# EAGLE design IOIO (EAGLE 6.3)
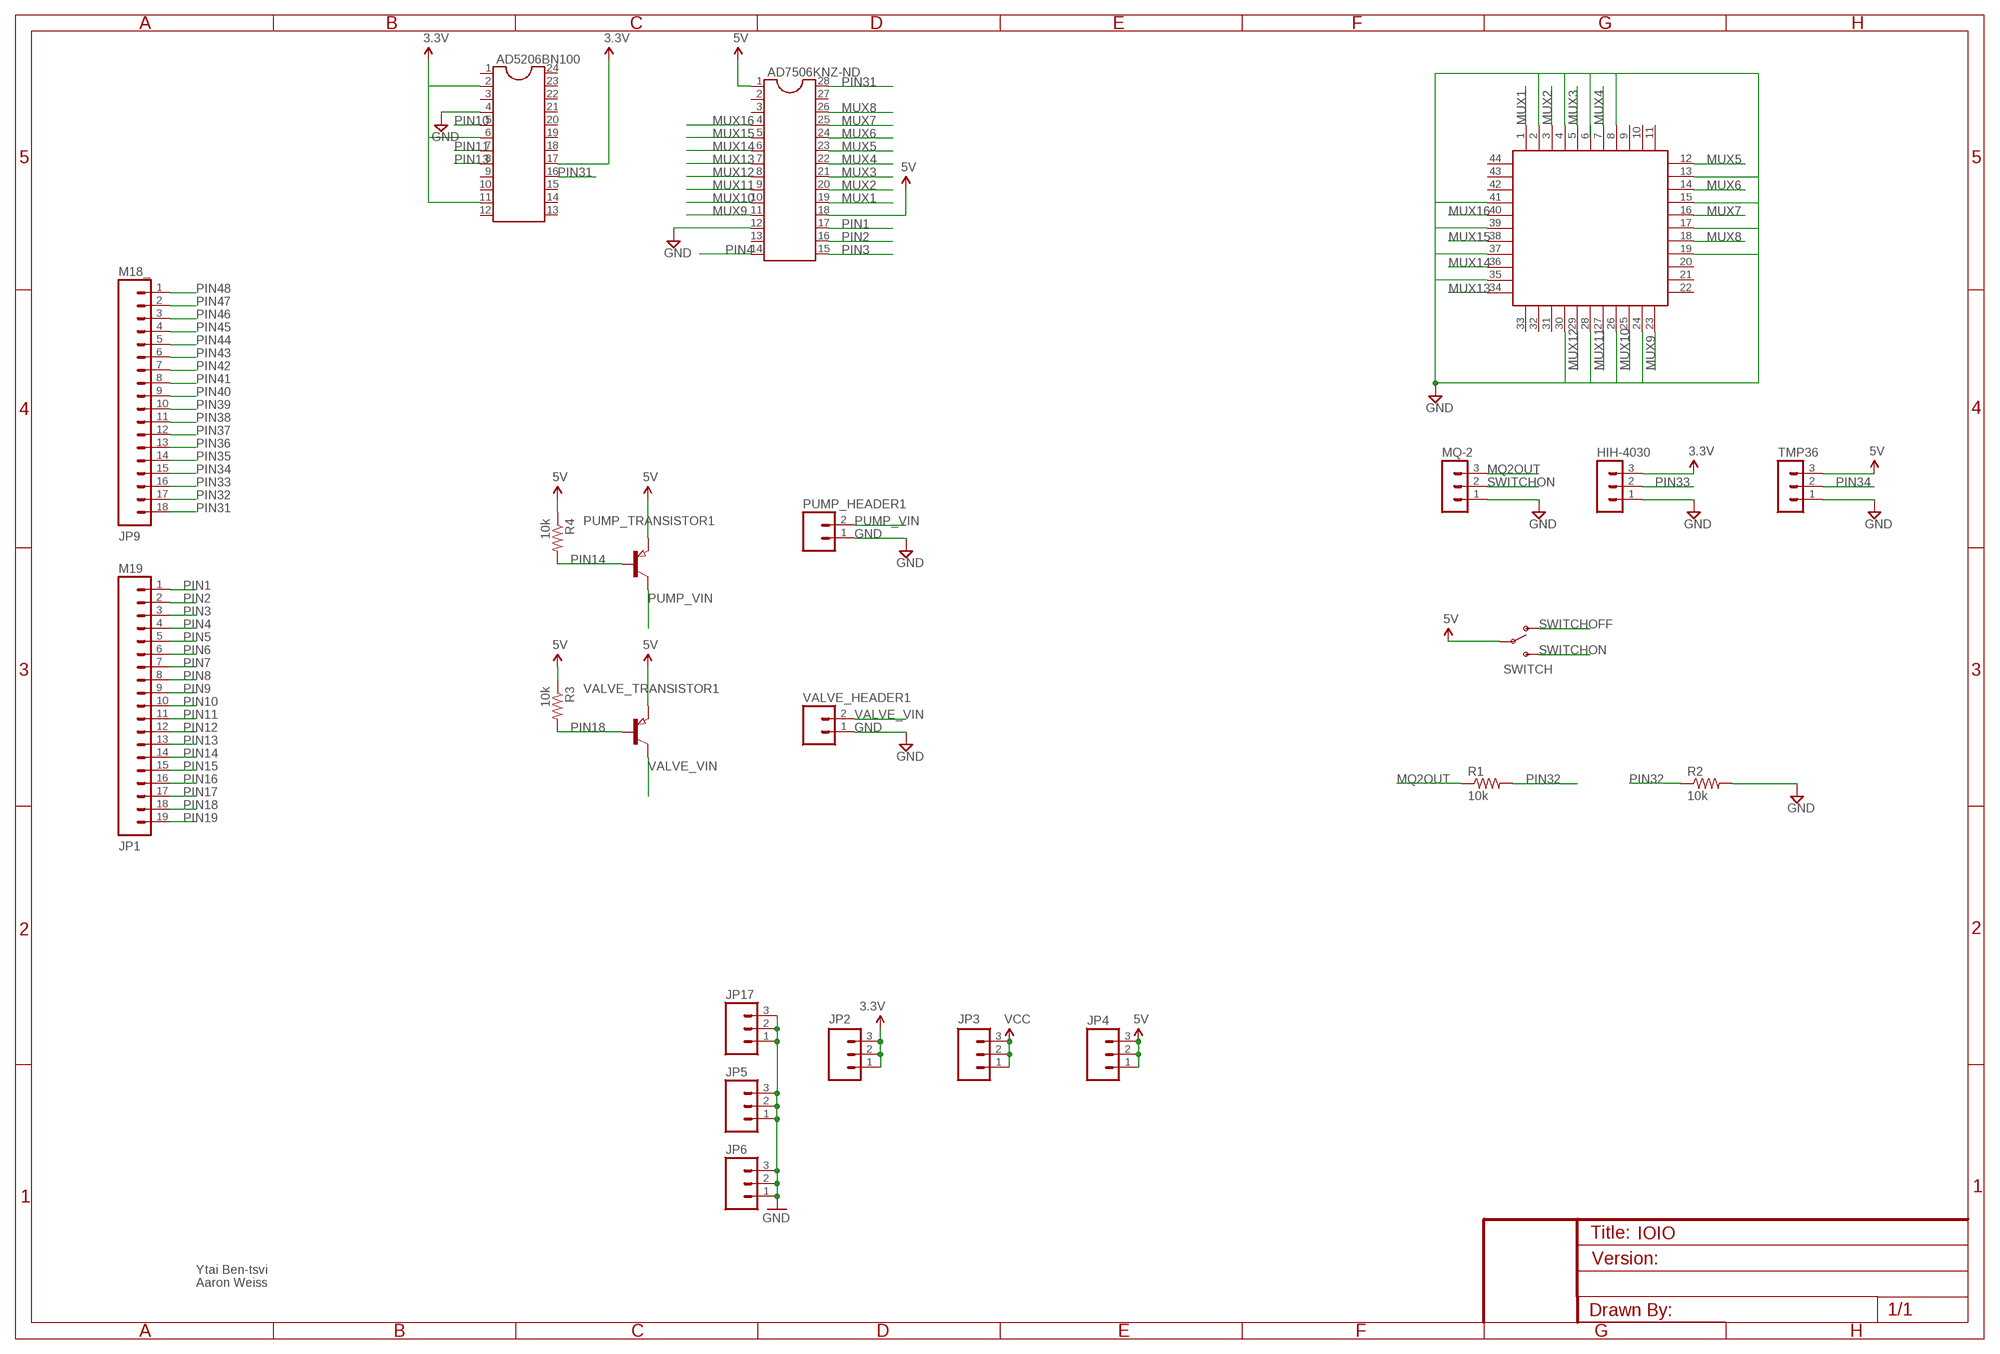
[diagram p0: schematic, sheet 1]

## Parts
AD5206BN100  DIL24-3  [DIL24-3]
AD7506KNZ-ND  DIL28  [DIL28-6]
HIH-4030  MA03-1  [MA03-1]
JP1  M19  [1X19]
JP2  M03PTH  [1X03]
JP3  M03PTH  [1X03]
JP4  M03PTH  [1X03]
JP5  M03PTH  [1X03]
JP6  M03PTH  [1X03]
JP9  M18_  [1X18]
JP17  M03PTH  [1X03]
MQ-2  MA03-1  [MA03-1]
PUMP_HEADER1  M02PTH  [1X02]
PUMP_TRANSISTOR1  PNP-TRANSISTOR_SOT23  [SOT23]
R1  10k  R-US_0207/7  [0207/7]
R2  10k  R-US_0207/7  [0207/7]
R3  10k  R-US_M2012  [M2012]
R4  10k  R-US_M2012  [M2012]
SWITCH  SWITCH-SPSTPTH  [SWITCH-SPDT]
TMP36  MA03-1  [MA03-1]
U$1  S44  [S44]
VALVE_HEADER1  M02PTH  [1X02]
VALVE_TRANSISTOR1  PNP-TRANSISTOR_SOT23  [SOT23]

## Nets
3.3V: AD5206BN100.2 AD5206BN100.6 AD5206BN100.11 AD5206BN100.17 HIH-4030.3 JP2.1 JP2.2 JP2.3
5V: AD7506KNZ-ND.1 AD7506KNZ-ND.18 JP4.1 JP4.2 JP4.3 PUMP_TRANSISTOR1.2(E) R3.1 R4.1 SWITCH.2(P) TMP36.3 VALVE_TRANSISTOR1.2(E)
GND: AD5206BN100.4 AD7506KNZ-ND.12 HIH-4030.1 JP5.1 JP5.2 JP5.3 JP6.1 JP6.2 JP6.3 JP17.1 JP17.2 JP17.3 MQ-2.1 PUMP_HEADER1.1 R2.2 TMP36.1 U$1.2 U$1.4 U$1.8 U$1.13 U$1.15 U$1.17 U$1.19 U$1.24 U$1.26 U$1.28 U$1.30 U$1.35 U$1.37 U$1.39 U$1.41 VALVE_HEADER1.1
MQ2OUT: MQ-2.3 R1.1
MUX1: AD7506KNZ-ND.19 U$1.1
MUX2: AD7506KNZ-ND.20 U$1.3
MUX3: AD7506KNZ-ND.21 U$1.5
MUX4: AD7506KNZ-ND.22 U$1.7
MUX5: AD7506KNZ-ND.23 U$1.12
MUX6: AD7506KNZ-ND.24 U$1.14
MUX7: AD7506KNZ-ND.25 U$1.16
MUX8: AD7506KNZ-ND.26 U$1.18
MUX9: AD7506KNZ-ND.11 U$1.23
MUX10: AD7506KNZ-ND.10 U$1.25
MUX11: AD7506KNZ-ND.9 U$1.27
MUX12: AD7506KNZ-ND.8 U$1.29
MUX13: AD7506KNZ-ND.7 U$1.34
MUX14: AD7506KNZ-ND.6 U$1.36
MUX15: AD7506KNZ-ND.5 U$1.38
MUX16: AD7506KNZ-ND.4 U$1.40
PIN1: AD7506KNZ-ND.17 JP1.1
PIN2: AD7506KNZ-ND.16 JP1.2
PIN3: AD7506KNZ-ND.15 JP1.3
PIN4: AD7506KNZ-ND.14 JP1.4
PIN5: JP1.5
PIN6: JP1.6
PIN7: JP1.7
PIN8: JP1.8
PIN9: JP1.9
PIN10: AD5206BN100.5 JP1.10
PIN11: AD5206BN100.7 JP1.11
PIN12: JP1.12
PIN13: AD5206BN100.8 JP1.13
PIN14: JP1.14 PUMP_TRANSISTOR1.1(B) R4.2
PIN15: JP1.15
PIN16: JP1.16
PIN17: JP1.17
PIN18: JP1.18 R3.2 VALVE_TRANSISTOR1.1(B)
PIN19: JP1.19
PIN31: AD5206BN100.16 AD7506KNZ-ND.28 JP9.18
PIN32: JP9.17 R1.2 R2.1
PIN33: HIH-4030.2 JP9.16
PIN34: JP9.15 TMP36.2
PIN35: JP9.14
PIN36: JP9.13
PIN37: JP9.12
PIN38: JP9.11
PIN39: JP9.10
PIN40: JP9.9
PIN41: JP9.8
PIN42: JP9.7
PIN43: JP9.6
PIN44: JP9.5
PIN45: JP9.4
PIN46: JP9.3
PIN47: JP9.2
PIN48: JP9.1
PUMP_VIN: PUMP_HEADER1.2 PUMP_TRANSISTOR1.3(C)
SWITCHOFF: SWITCH.1(O)
SWITCHON: MQ-2.2 SWITCH.3(S)
VALVE_VIN: VALVE_HEADER1.2 VALVE_TRANSISTOR1.3(C)
VCC: JP3.1 JP3.2 JP3.3
Unconnected: AD5206BN100.1 AD5206BN100.3 AD5206BN100.9 AD5206BN100.10 AD5206BN100.12 AD5206BN100.13 AD5206BN100.14 AD5206BN100.15 AD5206BN100.18 AD5206BN100.19 AD5206BN100.20 AD5206BN100.21 AD5206BN100.22 AD5206BN100.23 AD5206BN100.24 AD7506KNZ-ND.2 AD7506KNZ-ND.3 AD7506KNZ-ND.13 AD7506KNZ-ND.27 U$1.6 U$1.9 U$1.10 U$1.11 U$1.20 U$1.21 U$1.22 U$1.31 U$1.32 U$1.33 U$1.42 U$1.43 U$1.44

## Notes on the sheet
- Ytai Ben-tsvi
- Aaron Weiss

## Library data of the parts
AD5206BN100 = ic-package:DIL24: Dual In Line
AD7506KNZ-ND = ic-package:DIL28: Dual In Line
HIH-4030 MQ-2 TMP36 = con-lstb:MA03-1: PIN HEADER; OC_FARNELL: unknown; OC_NEWARK: unknown
JP1 = SparkFun:M19
JP2-JP6 JP17 = SparkFun:M03: Header 3 Standard 3-pin 0.1" header. Use with straight break away headers (SKU : PRT-00116), right angle break away headers (PRT-00553), swiss pins (PRT-00743), machine pins (PRT-00117), and female headers (PRT-00115). Molex polarized connector foot print use with SKU : PRT-08232 with associated crimp pins and housings.
JP9 = SparkFun:M18
PUMP_HEADER1 VALVE_HEADER1 = SparkFun:M02: Header 2 Standard 2-pin 0.1" header. Use with straight break away headers (SKU : PRT-00116), right angle break away headers (PRT-00553), swiss pins (PRT-00743), machine pins (PRT-00117), and female headers (PRT-00115). Molex polarized connector foot print use with SKU : PRT-08233 with associated crimp pins and housings.
PUMP_TRANSISTOR1 VALVE_TRANSISTOR1 = semicon-smd-ipc:PNP-TRANSISTOR_: PNP TRANSISTOR
R1-R4 = rcl:R-US_: RESISTOR, American symbol
SWITCH = SparkFun:SWITCH-SPST: SPST Switch Simple slide switch. Spark Fun Electronics SKU : COM-00102
U$1 = plcc-socket:S44: 44-pin PLCC through-hole socket

## Board
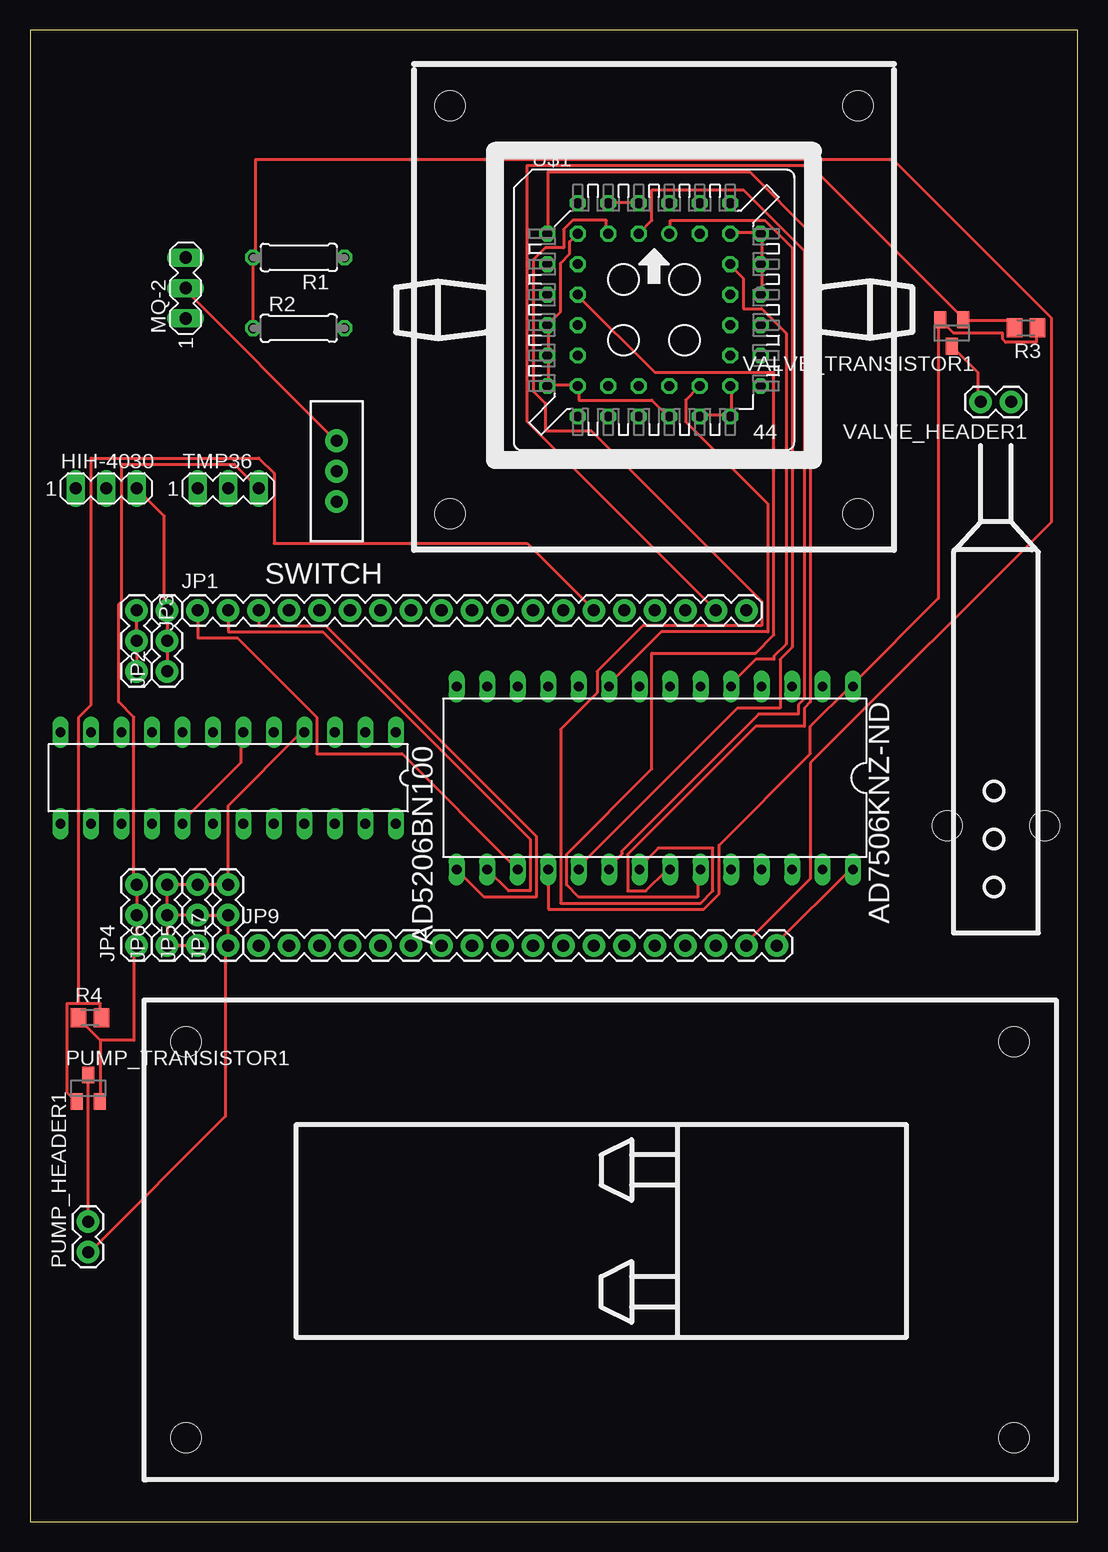
[diagram p1: board, top side]
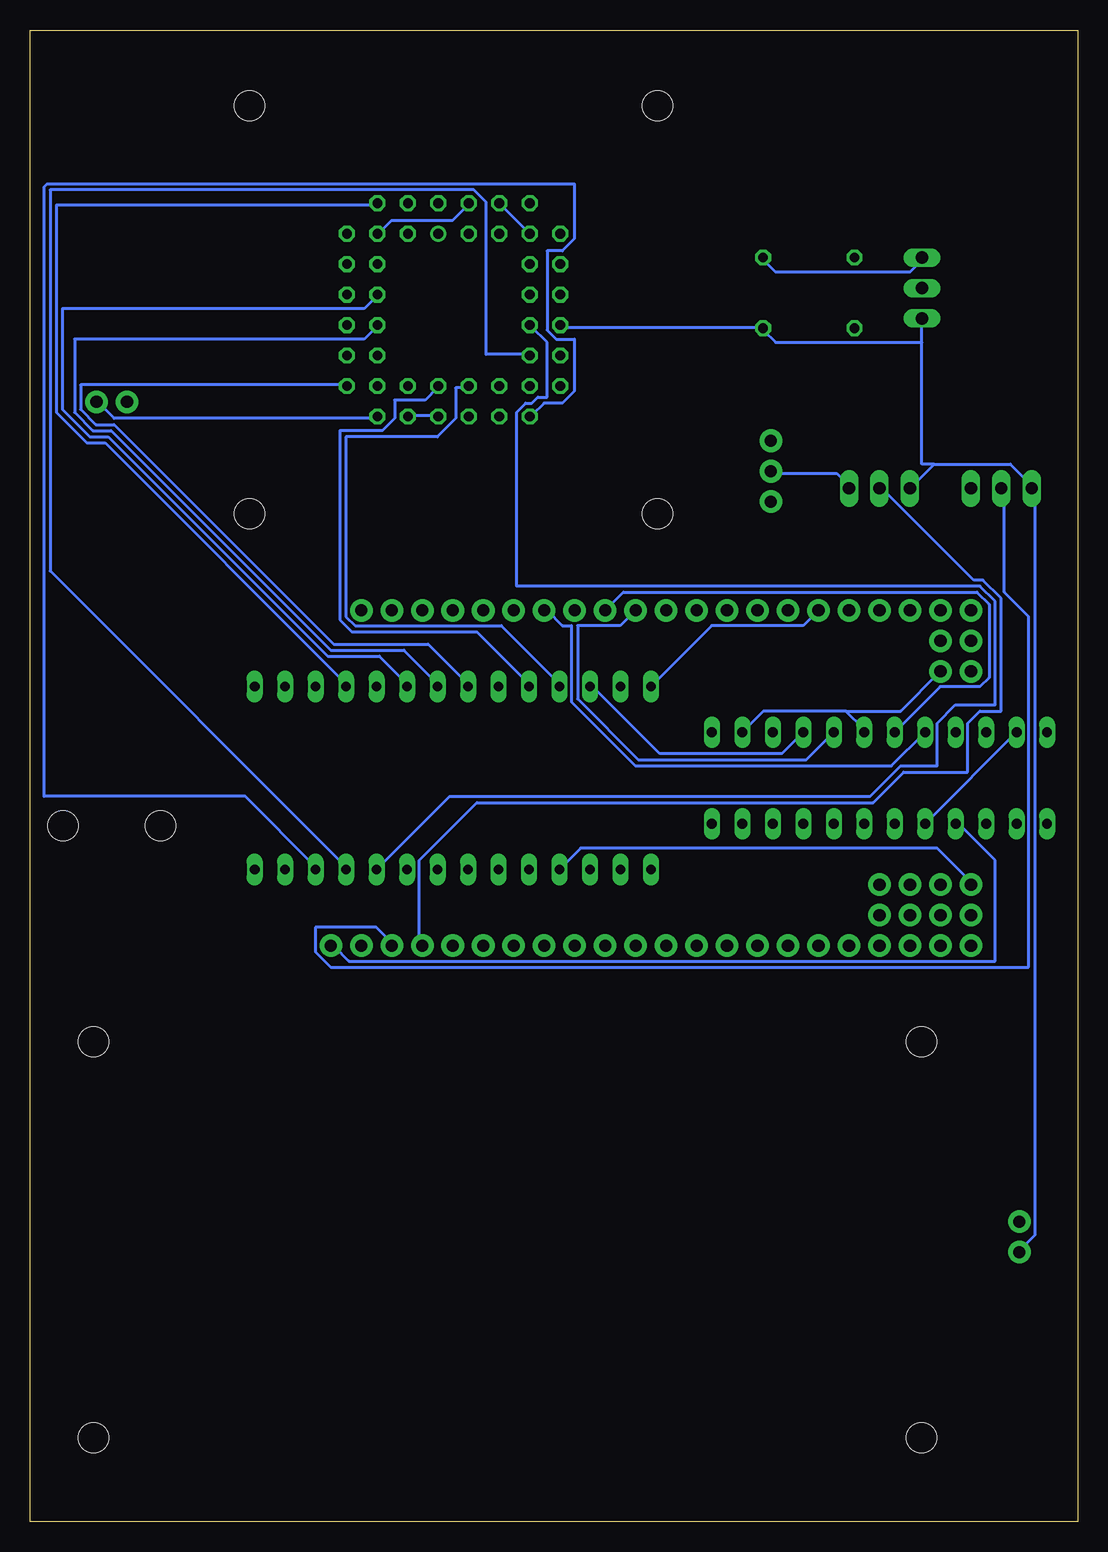
[diagram p2: board, bottom side, seen from below]

Size 87.3 x 124.32 mm. Coordinates in mm from the lower left corner, seen from the top.
Outline: 0,0 87.3,0 87.3,124.32 0,124.32 0,0
Copper layers (1*16): Top 0.035mm / dielectric 1.5mm / Bottom 0.035mm
Design rules "default": minimum track width 10mil, minimum drill 24mil, track to track 8mil, track to pad 8mil, pad to pad 8mil, via to via 8mil, smd to smd 8mil, copper to edge 40mil, drill to drill 8mil, minimum pad ring 10mil, minimum via ring 8mil, stop-mask expansion 4mil, vias tented up to drill 0mil, thermal gap 10mil
Holes 2.5 mm at 84.55,58 76.43,58 35,118 69,118 69,84 35,84 82,40 82,7 13,7 13,40

### Footprints (pad centres in the part's own frame; a part is rotated, then mirrored left to right if it is on the bottom)
DIL24-3 = drill 0.813 long: 1 -13.97,-3.81; 2 -11.43,-3.81; 3 -8.89,-3.81; 4 -6.35,-3.81; 5 -3.81,-3.81; 6 -1.27,-3.81; 7 1.27,-3.81; 8 3.81,-3.81; 9 6.35,-3.81; 10 8.89,-3.81; 11 11.43,-3.81; 12 13.97,-3.81; 13 13.97,3.81; 14 11.43,3.81; 15 8.89,3.81; 16 6.35,3.81; 17 3.81,3.81; 18 1.27,3.81; 19 -1.27,3.81; 20 -3.81,3.81; 21 -6.35,3.81; 22 -8.89,3.81; 23 -11.43,3.81; 24 -13.97,3.81
DIL28-6 = drill 0.813 long: 1 -16.51,-7.62; 2 -13.97,-7.62; 3 -11.43,-7.62; 4 -8.89,-7.62; 5 -6.35,-7.62; 6 -3.81,-7.62; 7 -1.27,-7.62; 8 1.27,-7.62; 9 3.81,-7.62; 10 6.35,-7.62; 11 8.89,-7.62; 12 11.43,-7.62; 13 13.97,-7.62; 14 16.51,-7.62; 15 16.51,7.62; 16 13.97,7.62; 17 11.43,7.62; 18 8.89,7.62; 19 6.35,7.62; 20 3.81,7.62; 21 1.27,7.62; 22 -1.27,7.62; 23 -3.81,7.62; 24 -6.35,7.62; 25 -8.89,7.62; 26 -11.43,7.62; 27 -13.97,7.62; 28 -16.51,7.62
MA03-1 = drill 1.016 long: 1 -2.54,0; 2 0,0; 3 2.54,0
1X19 = drill 1.016 pad 1.88: 1 0,0; 2 2.54,0; 3 5.08,0; 4 7.62,0; 5 10.16,0; 6 12.7,0; 7 15.24,0; 8 17.78,0; 9 20.32,0; 10 22.86,0; 11 25.4,0; 12 27.94,0; 13 30.48,0; 14 33.02,0; 15 35.56,0; 16 38.1,0; 17 40.64,0; 18 43.18,0; 19 45.72,0
1X03 = drill 1.016 pad 1.88: 1 0,0; 2 2.54,0; 3 5.08,0
1X18 = drill 1.016 pad 1.88: 1 0,0; 2 2.54,0; 3 5.08,0; 4 7.62,0; 5 10.16,0; 6 12.7,0; 7 15.24,0; 8 17.78,0; 9 20.32,0; 10 22.86,0; 11 25.4,0; 12 27.94,0; 13 30.48,0; 14 33.02,0; 15 35.56,0; 16 38.1,0; 17 40.64,0; 18 43.18,0
1X02 = drill 1.016 pad 1.88: 1 0,0; 2 2.54,0
SOT23 = smd 1 x 1.4: 1 -0.95,-1.1; 2 0.95,-1.1; 3 0,1.1
0207/7 = drill 0.813 octagon: 1 -3.81,0; 2 3.81,0
M2012 = smd 1.3 x 1.6: 1 -0.95,0; 2 0.95,0
SWITCH-SPDT = drill 1.016 pad 1.88: 1 0,2.54; 2 0,0; 3 0,-2.54
S44 = drill 0.813: 1 1.27,6.35 | drill 0.813 octagon: 2 -1.27,8.89; 3 -1.27,6.35; 4 -3.81,8.89; 5 -3.81,6.35; 6 -6.35,8.89; 7 -8.89,6.35; 8 -6.35,6.35; 9 -8.89,3.81; 10 -6.35,3.81; 11 -8.89,1.27; 12 -6.35,1.27; 13 -8.89,-1.27; 14 -6.35,-1.27; 15 -8.89,-3.81; 16 -6.35,-3.81; 17 -8.89,-6.35; 18 -6.35,-8.89; 19 -6.35,-6.35; 20 -3.81,-8.89; 21 -3.81,-6.35; 22 -1.27,-8.89; 23 -1.27,-6.35; 24 1.27,-8.89; 25 1.27,-6.35; 26 3.81,-8.89; 27 3.81,-6.35; 28 6.35,-8.89; 29 8.89,-6.35; 30 6.35,-6.35; 31 8.89,-3.81; 32 6.35,-3.81; 33 8.89,-1.27; 34 6.35,-1.27; 35 8.89,1.27; 36 6.35,1.27; 37 8.89,3.81; 38 6.35,3.81; 39 8.89,6.35; 40 6.35,8.89; 41 6.35,6.35; 42 3.81,8.89; 43 3.81,6.35; 44 1.27,8.89

### Placement (x,y rotation side)
AD5206BN100  16.51,61.99 180 top
AD7506KNZ-ND  52.07,61.99 180 top
HIH-4030  6.35,86.12 0 top
JP1  13.97,75.96 0 top
JP2  11.43,70.88 90 top
JP3  8.89,75.96 270 top
JP4  8.89,48.02 90 top
JP5  13.97,48.02 90 top
JP6  11.43,48.02 90 top
JP9  19.05,48.02 0 top
JP17  16.51,48.02 90 top
MQ-2  12.97,102.82 90 top
PUMP_HEADER1  4.85,22.47 90 top
PUMP_TRANSISTOR1  4.85,36.13 0 top
R1  22.4,105.36 180 top
R2  22.4,99.47 0 top
R3  83,99.5 180 top
R4  5,42 0 top
SWITCH  25.56,87.55 180 top
TMP36  16.51,86.12 0 top
U$1  52,101 0 top
VALVE_HEADER1  81.76,93.33 180 top
VALVE_TRANSISTOR1  76.8,99.07 180 top

### Tracks (layer width: path | path; a pad name or v marks a point on that pad's centre or on a via)
3.3V
  Top 0.254: JP2.1 11.45,71.12 11.45,73.41 JP2.2 11.45,73.66 11.45,75.95 JP2.3 11.19,76.2 11.19,83.82 8.91,86.11 HIH-4030.3 | AD5206BN100.17 12.72,58.42 17.54,63.25 17.54,65.79 AD5206BN100.6
  Bottom 0.254: AD5206BN100.11 5.1,65.79 12.46,58.42 AD5206BN100.17 | 19.32,67.56 26.18,67.56 27.7,66.04 AD5206BN100.2 | 19.32,67.56 17.8,66.04 AD5206BN100.6 | 19.32,67.56 14.75,67.56 11.45,70.87 JP2.1
5V
  Top 0.254: R3.1 83.84,99.31 83.84,98.3 81.3,98.3 81.04,98.55 81.04,99.06 76.98,99.06 75.96,100.08 VALVE_TRANSISTOR1.2 75.71,100.08 75.71,76.96 68.6,69.85 AD7506KNZ-ND.1 68.34,69.6 65.04,66.29 65.04,64.01 57.42,56.39 57.42,52.32 56.15,51.05 43.2,51.05 43.2,54.36 AD7506KNZ-ND.18 | 5.86,40.13 5.86,35.05 PUMP_TRANSISTOR1.2 | 5.86,40.13 4.08,41.91 R4.1 | 5.86,40.13 8.65,40.13 8.65,48.01 JP4.1 8.91,48.26 8.91,50.55 JP4.2 8.91,50.8 8.91,53.09 JP4.3 8.65,53.34 8.65,67.06 7.38,68.33 7.38,76.45 7.64,76.71 7.64,88.14 17.03,88.14 18.81,86.36 TMP36.3
  Bottom 0.254: TMP36.3 19.07,86.36 20.08,87.38 25.42,87.38 SWITCH.2 | AD7506KNZ-ND.18 42.94,54.61 41.42,56.13 11.7,56.13 8.91,53.34 JP4.3
GND
  Top 0.254: PUMP_HEADER1.1 5.1,22.61 16.27,33.78 16.27,48.01 JP17.1 16.53,48.26 16.53,50.55 JP17.2 16.27,50.55 13.99,50.55 JP5.2 13.73,50.55 11.45,50.55 | 11.45,53.09 13.73,53.09 JP5.3 13.99,53.09 16.27,53.09 JP17.3 16.53,53.34 16.53,59.69 22.62,65.79 AD5206BN100.4 | JP5.1 13.73,48.01 11.45,48.01 JP6.1 11.45,48.26 11.45,50.55 | 11.45,50.55 JP6.2 11.45,50.8 11.45,53.09 | 11.45,53.09 JP6.3 | U$1.30 58.44,94.49 58.44,92.2 U$1.28 58.18,92.2 55.9,92.2 U$1.26 | U$1.2 50.56,109.98 48.28,109.98 U$1.4 | U$1.35 60.98,102.36 60.98,104.65 U$1.37 60.98,104.9 60.98,107.19 U$1.39 60.72,107.44 58.44,107.44 U$1.41 | 43.2,94.74 43.2,97.03 U$1.15 43.2,97.28 43.2,99.57 U$1.13 43.2,99.82 44.21,100.84 44.21,104.9 44.97,105.66 44.97,106.68 45.48,107.19 U$1.8 | 43.2,94.74 45.48,94.74 U$1.19 45.74,94.49 45.74,93.47 51.83,93.47 53.1,92.2 U$1.24 | 43.2,94.74 U$1.17
  Bottom 0.254: AD7506KNZ-ND.12 40.4,69.6 34.81,64.01 24.65,64.01 22.88,65.79 AD5206BN100.4 | U$1.24 53.36,92.2 55.64,92.2 U$1.26 | VALVE_HEADER1.1 81.55,93.22 80.28,91.95 58.44,91.95 U$1.28 | 11.95,88.14 5.6,88.14 3.83,86.36 HIH-4030.1 3.57,86.11 3.57,23.88 4.84,22.61 PUMP_HEADER1.1 | 11.95,88.14 13.73,86.36 TMP36.1 | 12.97,98.3 12.97,88.14 11.95,88.14 | 12.97,98.3 MQ-2.1 | U$1.8 45.74,107.44 48.02,109.73 U$1.4 | U$1.2 50.82,109.73 52.09,108.46 57.17,108.46 58.18,107.44 U$1.41 | U$1.13 42.94,99.57 26.43,99.57 R2.2 26.18,99.31 25.16,98.3 12.97,98.3
MQ2OUT
  Bottom 0.254: R1.1 26.18,105.16 25.16,104.14 13.99,104.14 12.97,105.16 MQ-2.3
MUX1
  Top 0.254: AD7506KNZ-ND.19 45.74,54.61 58.94,67.82 62.5,67.82 62.5,71.88 63.52,72.9 63.52,106.17 61.23,108.46 53.36,108.46 53.36,107.44 U$1.1
MUX2
  Top 0.254: AD7506KNZ-ND.20 48.28,54.61 49.29,55.63 49.29,55.88 60.72,67.31 64.02,67.31 64.02,68.07 64.53,68.58 64.53,105.92 59.45,111 51.83,111 51.83,108.46 50.82,107.44 U$1.3
MUX3
  Top 0.254: AD7506KNZ-ND.21 50.82,54.61 52.34,56.13 56.91,56.13 56.91,52.58 55.9,51.56 44.21,51.56 44.21,66.04 47.26,69.09 47.26,70.87 51.07,74.68 60.98,74.68 60.98,76.71 46.75,90.93 42.94,90.93 42.94,93.22 41.93,94.23 41.93,105.16 42.94,106.17 44.47,106.17 44.47,107.7 45.23,108.46 48.02,108.46 48.02,107.44 U$1.5
MUX4
  Top 0.254: AD7506KNZ-ND.22 53.1,54.36 51.32,52.58 49.8,52.58 49.8,55.63 60.47,66.29 64.53,66.29 64.53,67.82 65.04,68.33 65.04,107.44 59.96,112.52 43.2,112.52 43.2,107.44 U$1.7
MUX5
  Top 0.254: U$1.12 45.74,102.11 52.09,95.76 61.99,95.76 61.99,73.91 60.47,72.39 51.83,72.39 51.83,62.74 44.72,55.63 44.72,53.09 45.74,52.07 55.64,52.07 55.64,54.36 AD7506KNZ-ND.23
MUX6
  Bottom 0.254: U$1.14 45.48,99.57 44.21,98.3 44.21,93.73 44.97,93.73 45.48,93.22 45.99,93.22 46.75,92.46 46.75,77.98 8.14,77.98 6.87,76.71 6.87,68.07 10.18,68.07 11.7,66.55 11.7,62.99 14.75,62.99 17.29,60.45 52.34,60.45 58.18,54.61 AD7506KNZ-ND.24
MUX7
  Bottom 0.254: AD7506KNZ-ND.25 60.98,54.61 85.61,79.25 85.61,111 50.31,111 49.29,109.98 49.29,97.28 45.74,97.28 U$1.16
MUX8
  Bottom 0.254: U$1.18 45.48,92.2 44.47,93.22 42.94,93.22 41.93,94.23 41.93,98.55 43.45,98.55 44.21,99.31 44.21,105.92 42.94,105.92 41.93,106.93 41.93,111.51 85.87,111.51 86.12,111.25 86.12,60.45 69.36,60.45 63.52,54.61 AD7506KNZ-ND.26
MUX9
  Bottom 0.254: AD7506KNZ-ND.11 43.2,69.85 48.02,74.68 60.21,74.68 60.98,75.44 60.98,90.42 53.36,90.42 51.83,91.95 51.83,94.49 50.82,94.49 U$1.23
MUX10
  Bottom 0.254: AD7506KNZ-ND.10 45.74,69.85 50.05,74.17 60.47,74.17 61.48,75.18 61.48,90.93 57.93,90.93 56.91,91.95 56.91,93.47 54.37,93.47 53.36,94.49 U$1.25
MUX11
  Top 0.254: AD7506KNZ-ND.9 48.28,69.85 52.59,74.17 61.48,74.17 61.48,84.84 54.63,91.69 54.63,93.47 55.64,94.49 U$1.27
MUX12
  Bottom 0.254: AD7506KNZ-ND.8 50.82,69.85 54.12,73.15 61.99,73.15 80.28,91.44 81.8,91.44 83.07,92.71 83.07,94.74 60.98,94.74 U$1.29
MUX13
  Bottom 0.254: AD7506KNZ-ND.7 53.36,69.85 56.15,72.64 62.25,72.64 80.53,90.93 82.06,90.93 83.58,92.46 83.58,98.55 59.45,98.55 58.44,99.57 U$1.34
MUX14
  Bottom 0.254: AD7506KNZ-ND.6 55.9,69.85 58.18,72.14 62.5,72.14 80.79,90.42 82.31,90.42 84.6,92.71 84.6,101.09 59.45,101.09 58.44,102.11 U$1.36
MUX15
  Top 0.254: AD7506KNZ-ND.5 58.44,69.85 60.47,71.88 61.99,71.88 61.99,72.14 63.01,73.15 63.01,99.06 60.98,101.09 59.45,101.09 59.45,103.63 58.44,104.65 U$1.38
MUX16
  Bottom 0.254: AD7506KNZ-ND.4 60.98,69.85 81.04,89.92 82.57,89.92 85.11,92.46 85.11,109.73 58.44,109.73 U$1.40
PIN1
  Top 0.254: AD7506KNZ-ND.17 40.4,54.61 31,64.01 23.89,64.01 23.89,67.06 17.29,73.66 13.99,73.66 13.99,75.95 JP1.1
PIN2
  Top 0.254: AD7506KNZ-ND.16 38.12,54.36 39.89,52.58 41.67,52.58 41.67,56.9 24.4,74.17 16.53,74.17 16.53,75.95 JP1.2
PIN3
  Top 0.254: AD7506KNZ-ND.15 35.58,54.36 37.86,52.07 42.18,52.07 42.18,57.15 24.65,74.68 19.07,74.68 19.07,75.95 JP1.3
PIN4
  Bottom 0.254: AD7506KNZ-ND.14 35.32,69.85 30.5,74.68 22.88,74.68 21.61,75.95 JP1.4
PIN10
  Bottom 0.254: AD5206BN100.5 20.34,65.79 22.62,63.5 36.59,63.5 41.67,68.58 41.67,74.68 38.12,74.68 36.85,75.95 JP1.10
PIN11
  Bottom 0.254: AD5206BN100.7 15,66.04 11.45,69.6 8.14,69.6 7.38,70.36 7.38,76.45 8.4,77.47 37.86,77.47 39.13,76.2 JP1.11
PIN13
  Bottom 0.254: AD5206BN100.8 12.72,65.79 15.51,62.99 36.85,62.99 42.18,68.33 42.18,74.68 42.94,74.68 44.21,75.95 JP1.13
PIN14
  Top 0.254: 4.08,43.18 5.86,43.18 5.86,42.16 R4.2 | 4.08,43.18 3.06,43.18 3.06,35.81 3.83,35.05 PUMP_TRANSISTOR1.1 | 4.08,43.18 4.08,67.06 5.1,68.07 5.1,88.65 19.07,88.65 20.34,87.38 20.34,81.53 41.42,81.53 46.75,76.2 JP1.14
PIN18
  Top 0.254: R3.2 81.8,99.57 81.8,100.08 77.99,100.08 VALVE_TRANSISTOR1.1 77.74,100.33 65.04,113.03 41.42,113.03 41.42,91.69 56.91,76.2 JP1.18
PIN31
  Top 0.254: AD7506KNZ-ND.28 68.34,54.36 62.25,48.26 JP9.18
  Bottom 0.254: AD5206BN100.16 9.92,58.17 6.87,55.12 6.87,46.74 60.72,46.74 61.99,48.01 JP9.18
PIN32
  Top 0.254: R2.1 18.56,99.57 18.56,105.16 R1.2 18.81,105.41 18.81,113.54 71.9,113.54 85.11,100.33 85.11,83.31 65.04,63.25 65.04,53.59 59.71,48.26 JP9.17
PIN33
  Bottom 0.254: HIH-4030.2 6.11,86.11 6.11,77.47 4.08,75.44 4.08,46.23 62.25,46.23 63.52,47.5 63.52,49.53 58.44,49.53 57.17,48.26 JP9.16
PIN34
  Bottom 0.254: TMP36.2 16.27,86.11 8.65,78.49 7.89,78.49 6.37,76.96 6.37,67.56 8.14,67.56 9.16,66.55 9.16,62.48 14.49,62.48 17.03,59.94 50.05,59.94 54.88,55.12 54.88,48.26 54.63,48.26 JP9.15
PUMP_VIN
  Top 0.254: PUMP_TRANSISTOR1.3 4.84,37.08 4.84,25.15 PUMP_HEADER1.2
SWITCHON
  Top 0.254: MQ-2.2 12.97,102.62 25.42,90.17 SWITCH.3
VALVE_VIN
  Top 0.254: VALVE_TRANSISTOR1.3 76.98,97.79 79.01,95.76 79.01,93.47 VALVE_HEADER1.2
VCC
  Top 0.254: JP3.3 8.91,71.12 8.91,73.41 JP3.2 8.91,73.66 8.91,75.95 JP3.1